# Altium schematic sheet MotherBoard_NucleoF401RE.SchDoc
size A; SheetNumber: 3; SheetTotal: 9
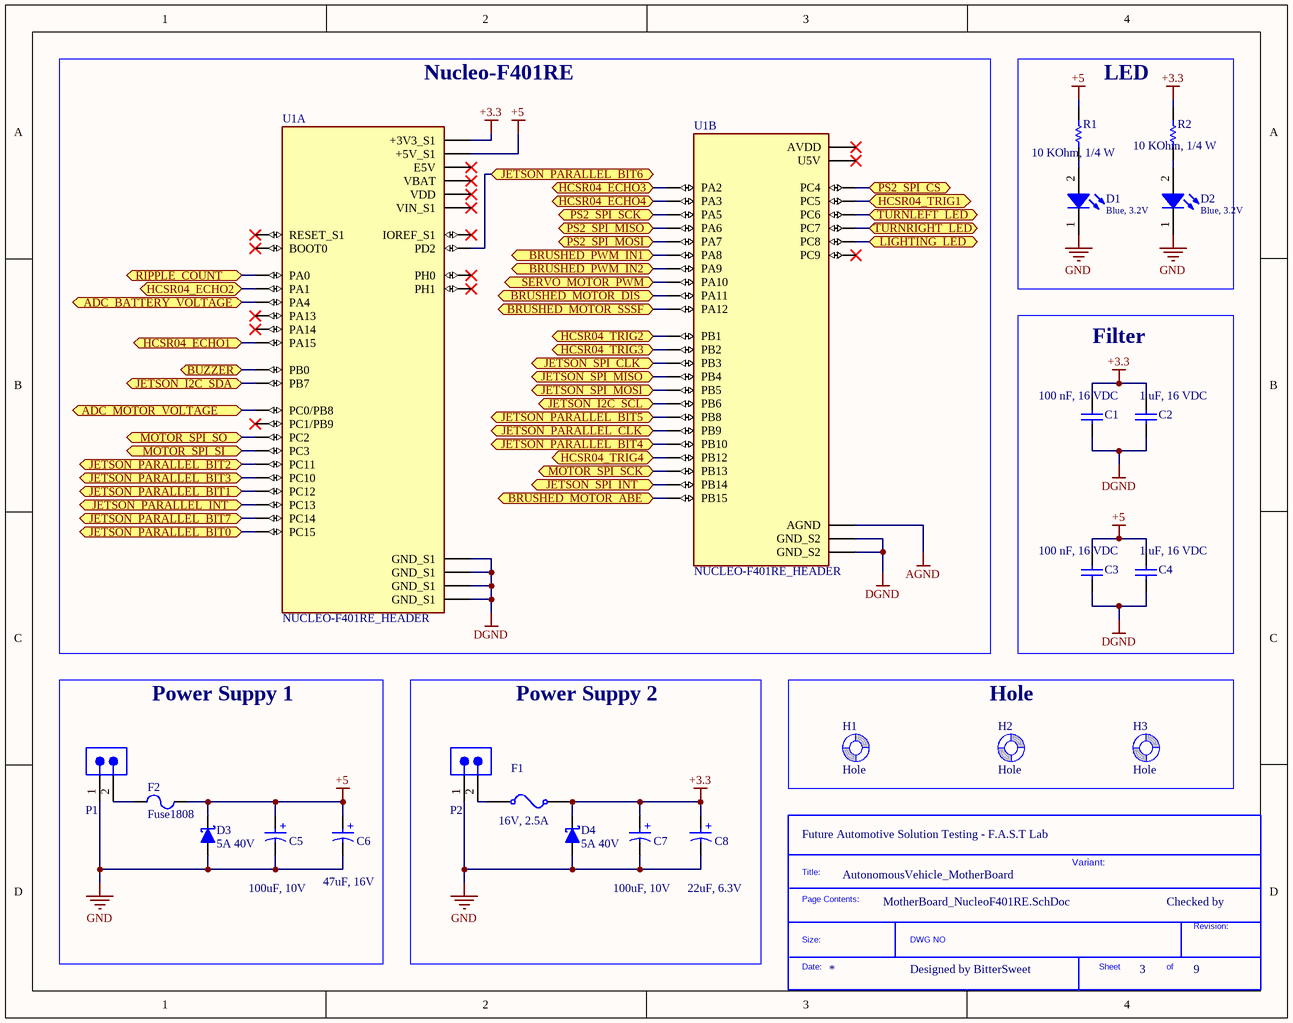
[diagram p0: MotherBoard_NucleoF401RE.SchDoc]

## Parts
*?  SDTitleBlock  (value not drawn)  (graphical)
C1  100 nF, 16 VDC  [CAP_0603]
C2  1 uF, 16 VDC  [CAP_0603]
C3  100 nF, 16 VDC  [CAP_0603]
C4  1 uF, 16 VDC  [CAP_0603]
C5  100uF, 10V  [WCAP-ASLI_D5H5.5]
C6  47uF, 16V  [WCAP-ASLI_D5H5.5]
C7  100uF, 10V  [WCAP-ASLI_D5H5.5]
C8  22uF, 6.3V  [WCAP-ASLI_D4H5.5]
D1  Blue, 3.2V  [WL-SMCW_0603_H=0.7mm]
D2  Blue, 3.2V  [WL-SMCW_0603_H=0.7mm]
D3  5A 40V  [DO-214AB, SMC]
D4  5A 40V  [DO-214AB, SMC]
F1  16V, 2.5A  [Fuse_SMD_1812]
F2  Fuse1808  [FuseHolder1808]
H1  Hole  [Hole_3.2mm]
H2  Hole  [Hole_3.2mm]
H3  Hole  [Hole_3.2mm]
P1  20A, 300V  [691312510002]  (value not drawn)
P2  20A, 300V  [691312510002]  (value not drawn)
R1  10 KOhm, 1/4 W  [resistor_0603]
R2  10 KOhm, 1/4 W  [resistor_0603]
U1  NUCLEO-F401RE_HEADER  [NUCLEO-F401RE-HEADER]  (parts A,B of 2)

## Blocks framed on the sheet
Nucleo-F401RE: U1
LED: D1 D2 R1 R2
Filter: C1-C4
Power Suppy 1: C5 C6 D3 F2 P1
Power Suppy 2: C7 C8 D4 F1 P2
Hole: H1-H3

## Ports
ADC_BATTERY_VOLTAGE (bidir), ADC_MOTOR_VOLTAGE (bidir), BRUSHED_MOTOR_ABE (bidir), BRUSHED_MOTOR_DIS (bidir), BRUSHED_MOTOR_SSSF (bidir), BRUSHED_PWM_IN1 (bidir), BRUSHED_PWM_IN2 (bidir), BUZZER (bidir), HCSR04_ECHO1 (bidir), HCSR04_ECHO2 (bidir), HCSR04_ECHO3 (bidir), HCSR04_ECHO4 (bidir), HCSR04_TRIG1 (bidir), HCSR04_TRIG2 (bidir), HCSR04_TRIG3 (bidir), HCSR04_TRIG4 (bidir), JETSON_I2C_SCL (bidir), JETSON_I2C_SDA (bidir), JETSON_PARALLEL_BIT0 (bidir), JETSON_PARALLEL_BIT1 (bidir), JETSON_PARALLEL_BIT2 (bidir), JETSON_PARALLEL_BIT3 (bidir), JETSON_PARALLEL_BIT4 (bidir), JETSON_PARALLEL_BIT5 (bidir), JETSON_PARALLEL_BIT6 (bidir), JETSON_PARALLEL_BIT7 (bidir), JETSON_PARALLEL_CLK (bidir), JETSON_PARALLEL_INT (bidir), JETSON_SPI_CLK (bidir), JETSON_SPI_INT (bidir), JETSON_SPI_MISO (bidir), JETSON_SPI_MOSI (bidir), LIGHTING_LED (bidir), MOTOR_SPI_SCK (bidir), MOTOR_SPI_SI (bidir), MOTOR_SPI_SO (bidir), PS2_SPI_CS (bidir), PS2_SPI_MISO (bidir), PS2_SPI_MOSI (bidir), PS2_SPI_SCK (bidir), RIPPLE_COUNT (bidir), SERVO_MOTOR_PWM (bidir), TURNLEFT_LED (bidir), TURNRIGHT_LED (bidir)

## Nets
+3.3: C1.2 C2.2 C7.1(P) C8.1(P) D4.2(K) F1.1 R2.1 U1.CN7_16(+3V3_S1)
+5: C3.2 C4.2 C5.1(P) C6.1(P) D3.2(K) F2.2 R1.1 U1.CN7_18(+5V_S1)
AGND: U1.CN10_32(AGND)
DGND: C1.1 C2.1 C3.1 C4.1 U1.CN7_8(GND_S1) U1.CN7_19(GND_S1) U1.CN7_20(GND_S1) U1.CN7_22(GND_S1) U1.CN10_9(GND_S2) U1.CN10_20(GND_S2)
GND: C5.2(N) C6.2(N) C7.2(N) C8.2(N) D1.1(K) D2.1(K) D3.1(A) D4.1(A) P1.1 P2.1
ADC_BATTERY_VOLTAGE: U1.CN7_32(PA4) ; port ADC_BATTERY_VOLTAGE
ADC_MOTOR_VOLTAGE: U1.CN7_38(PC0/PB8) ; port ADC_MOTOR_VOLTAGE
BRUSHED_MOTOR_ABE: U1.CN10_26(PB15) ; port BRUSHED_MOTOR_ABE
BRUSHED_MOTOR_DIS: U1.CN10_14(PA11) ; port BRUSHED_MOTOR_DIS
BRUSHED_MOTOR_SSSF: U1.CN10_12(PA12) ; port BRUSHED_MOTOR_SSSF
BRUSHED_PWM_IN1: U1.CN10_23(PA8) ; port BRUSHED_PWM_IN1
BRUSHED_PWM_IN2: U1.CN10_21(PA9) ; port BRUSHED_PWM_IN2
BUZZER: U1.CN7_34(PB0) ; port BUZZER
HCSR04_ECHO1: U1.CN7_17(PA15) ; port HCSR04_ECHO1
HCSR04_ECHO2: U1.CN7_30(PA1) ; port HCSR04_ECHO2
HCSR04_ECHO3: U1.CN10_35(PA2) ; port HCSR04_ECHO3
HCSR04_ECHO4: U1.CN10_37(PA3) ; port HCSR04_ECHO4
HCSR04_TRIG1: U1.CN10_6(PC5) ; port HCSR04_TRIG1
HCSR04_TRIG2: U1.CN10_24(PB1) ; port HCSR04_TRIG2
HCSR04_TRIG3: U1.CN10_22(PB2) ; port HCSR04_TRIG3
HCSR04_TRIG4: U1.CN10_16(PB12) ; port HCSR04_TRIG4
JETSON_I2C_SCL: U1.CN10_17(PB6) ; port JETSON_I2C_SCL
JETSON_I2C_SDA: U1.CN7_21(PB7) ; port JETSON_I2C_SDA
JETSON_PARALLEL_BIT0: U1.CN7_27(PC15) ; port JETSON_PARALLEL_BIT0
JETSON_PARALLEL_BIT1: U1.CN7_3(PC12) ; port JETSON_PARALLEL_BIT1
JETSON_PARALLEL_BIT2: U1.CN7_2(PC11) ; port JETSON_PARALLEL_BIT2
JETSON_PARALLEL_BIT3: U1.CN7_1(PC10) ; port JETSON_PARALLEL_BIT3
JETSON_PARALLEL_BIT4: U1.CN10_25(PB10) ; port JETSON_PARALLEL_BIT4
JETSON_PARALLEL_BIT5: U1.CN10_3(PB8) ; port JETSON_PARALLEL_BIT5
JETSON_PARALLEL_BIT6: U1.CN7_4(PD2) ; port JETSON_PARALLEL_BIT6
JETSON_PARALLEL_BIT7: U1.CN7_25(PC14) ; port JETSON_PARALLEL_BIT7
JETSON_PARALLEL_CLK: U1.CN10_5(PB9) ; port JETSON_PARALLEL_CLK
JETSON_PARALLEL_INT: U1.CN7_23(PC13) ; port JETSON_PARALLEL_INT
JETSON_SPI_CLK: U1.CN10_31(PB3) ; port JETSON_SPI_CLK
JETSON_SPI_INT: U1.CN10_28(PB14) ; port JETSON_SPI_INT
JETSON_SPI_MISO: U1.CN10_27(PB4) ; port JETSON_SPI_MISO
JETSON_SPI_MOSI: U1.CN10_29(PB5) ; port JETSON_SPI_MOSI
LIGHTING_LED: U1.CN10_2(PC8) ; port LIGHTING_LED
MOTOR_SPI_SCK: U1.CN10_30(PB13) ; port MOTOR_SPI_SCK
MOTOR_SPI_SI: U1.CN7_37(PC3) ; port MOTOR_SPI_SI
MOTOR_SPI_SO: U1.CN7_35(PC2) ; port MOTOR_SPI_SO
PS2_SPI_CS: U1.CN10_34(PC4) ; port PS2_SPI_CS
PS2_SPI_MISO: U1.CN10_13(PA6) ; port PS2_SPI_MISO
PS2_SPI_MOSI: U1.CN10_15(PA7) ; port PS2_SPI_MOSI
PS2_SPI_SCK: U1.CN10_11(PA5) ; port PS2_SPI_SCK
RIPPLE_COUNT: U1.CN7_28(PA0) ; port RIPPLE_COUNT
SERVO_MOTOR_PWM: U1.CN10_33(PA10) ; port SERVO_MOTOR_PWM
TURNLEFT_LED: U1.CN10_4(PC6) ; port TURNLEFT_LED
TURNRIGHT_LED: U1.CN10_19(PC7) ; port TURNRIGHT_LED
NetD1_2: D1.2(A) R1.2
NetD2_2: D2.2(A) R2.2
NetF1_0: F1.0 P2.2
NetF2_1: F2.1 P1.2

Not connected (* = marked no-connect by the designer): H1 1(Screw); H2 1(Screw); H3 1(Screw); U1 CN7_5(VDD)* CN7_6(E5V)* CN7_7(BOOT0)* CN7_12(IOREF_S1)* CN7_13(PA13)* CN7_14(RESET_S1)* CN7_15(PA14)* CN7_24(VIN_S1)* CN7_29(PH0)* CN7_31(PH1)* CN7_33(VBAT)* CN7_36(PC1/PB9)* CN10_1(PC9)* CN10_7(AVDD)* CN10_8(U5V)*

## Notes on the sheet
- (near *?) Future Automotive Solution Testing - F.A.S.T Lab
- AutonomousVehicle_MotherBoard
- Variant:
- Checked by
- Designed by BitterSweet
- (in symbol 865080140001) +
- (in symbol 865080142007) +
- (in symbol 865080342006) +
- (in symbol SDTitleBlock) Title:; Page Contents:; Revision:; Size:; DWG NO; Date:; Sheet; of

## Library data of the parts
C1 C3 = 0106031041050: CAP, size 0603, 100 nF, 16 VDC; Manufacture Name: TDK; Manufacture SN: CGA3E3X8R1H104K080AE; Capacitance: 100 nF; Tolerance: +/-10%; Voltage Rating DC: 16 VDC; ComponentLink2Description: Datasheet; ComponentLink2URL: https://product.tdk.com/system/files/dam/doc/product/capacitor/ceramic/mlcc/catalog/mlcc_automotive_soft_en.pdf?ref_disty=mouser; Operating Temperature: -55 to +125degC; Packaging: Tape and Reel; Mounting Technology: SMT; Size: 0603; Supplier 1 Name: Mouser; Supplier 1 SN: 810-CGA3E3X8R1H104KA; Supplier 1 URL: https://www.mouser.com/ProductDetail/TDK/CGA3E3X8R1H104K080AE?qs=nQSIdc08i%252Bd8g3IRRgU2bw%3D%3D&utm_source=mouser-refine-download&utm_medium=file&utm_campaign=CGA3E3X8R1H104K080AE&utm_content=TDK; Supplier 2 Name: Digi-Key; Supplier 2 SN: 445-173697-2-ND; Supplier 2 URL: https://www.digikey.com/en/products/detail/tdk-corporation/cga3e3x8r1h104k080ae/5809262; Supplier 3 Name: thegioiic; Supplier 3 SN: N/A; Supplier 3 URL: https://www.thegioiic.com/tu-gom-0603-100nf-0-1uf-16v; Value: 100 nF, 16 VDC; JLCPCB Part: C2173920; ComponentLink3Description: JLCPCB Link; ComponentLink3URL: https://jlcpcb.com/partdetail/TaiyoYuden-EMK107B7104KAHT/C2173920
C2 C4 = 0106031051016: CAP, size 0603, 1 uF, 16 VDC; Manufacture Name: Samsung Electro-Mechanics; Manufacture SN: CL10B105KO8NNWC; Capacitance: 1 uF; Tolerance: +/-10%; Voltage Rating DC: 16 VDC; ComponentLink2Description: Datasheet; ComponentLink2URL: https://www.mouser.vn/datasheet/2/585/Samsung_MLCC_1837944-1929650.pdf; Operating Temperature: -55 to +125degC; Packaging: Tape and Reel; Mounting Technology: SMT; Size: 0603; Supplier 1 Name: Mouser; Supplier 1 SN: 187-CL10B105KO8NNWC; Supplier 1 URL: https://www.mouser.vn/ProductDetail/Samsung-Electro-Mechanics/CL10B105KO8NNWC?qs=81r%252BiQLm7BT%252BXtc72qn1ug%3D%3D&utm_source=mouser-refine-download&utm_medium=file&utm_campaign=CL10B105KO8NNWC&utm_content=Samsung-Electro-Mechanics; Supplier 2 Name: Digi-Key; Supplier 2 SN: 1276-CL10B105KO8NNWCTR-ND; Supplier 2 URL: https://www.digikey.com/en/products/detail/samsung-electro-mechanics/cl10b105ko8nnwc/16572783; Supplier 3 Name: thegioiic; Supplier 3 SN: N/A; Supplier 3 URL: https://www.thegioiic.com/tu-gom-0603-1uf-16v; Value: 1 uF, 16 VDC; JLCPCB Part: C106858; ComponentLink3Description: JLCPCB Link; ComponentLink3URL: https://jlcpcb.com/partdetail/Yageo-CC0603KRX7R8BB105/C106858
C5 C7 = 865080142007: V-Chip, D5 x H5.5mm, 100uF, 10V; Manufacturer: Wurth Elektronik; Capacitance Tolerance: +/-20%; Dissipation Factor: 24%; Endurance: 2000h; Leakage Current: 6.3uA; Ripple Current: 170mA; Category: Aluminum Electrolytic Capacitors; ComponentLink2Description: Datasheet Link; ComponentLink2URL: https://www.we-online.com/redexpert/spec/865080142007?ad; Operating Temperature Max: 105°C; Operating Temperature Min: -55°C; Packaging: Tape and Reel; Height: 5.5mm; Diameter: 5mm; Capacitance: 100uF; Rated Voltage (DC): 10V; Supplier 1 Name: Mouser; Supplier 1 SN: 710-865080142007; Supplier 1 URL: https://www.mouser.vn/ProductDetail/Wurth-Elektronik/865080142007?qs=0KOYDY2FL2%2Fwso3YmuIP2w%3D%3D; Supplier 3 Name: thegioiic; Supplier 3 URL: https://www.thegioiic.com/tu-nhom-smd-100uf-10v-5x5-4mm-panasonic-eee1aa101war; Manufacturer Part Number: N/A; Mount: Surface Mount; Supplier 2 Name: Digi-Key; Supplier 2 SN: N/A; Supplier 2 URL: N/A; Supplier 3 SN: N/A; Value: 100uF, 10V; JLCPCB Part: C402534; ComponentLink3Description: JLCPCB Link; ComponentLink3URL: https://jlcpcb.com/partdetail/387824-HV101M010C055ETR/C402534
C6 = 865080342006: V-Chip, D5 x H5.5mm, 47uF, 16V; Manufacturer: Wurth Elektronik; Capacitance Tolerance: +/-20%; Dissipation Factor: 16%; Endurance: 2000h; Leakage Current: 7.52uA; Ripple Current: 195mA; Category: Aluminum Electrolytic Capacitors; ComponentLink2Description: Datasheet Link; ComponentLink2URL: https://www.we-online.com/redexpert/spec/865080342006?ad; Mount: Surface Mount; Operating Temperature Max: 105°C; Operating Temperature Min: -55°C; Packaging: Tape and Reel; Height: 5.5mm; Diameter: 5mm; Capacitance: 47uF; Rated Voltage (DC): 16V; Supplier 1 Name: Mouser; Supplier 1 SN: 710-865080262015; Supplier 1 URL: https://www.mouser.com/ProductDetail/Wurth-Elektronik/865080262015?qs=0KOYDY2FL2%2Ffe5w2MssUoQ%3D%3D; Supplier 3 Name: thegioiic; Supplier 3 URL: https://www.thegioiic.com/tu-nhom-smd-47uf-16v-5x5-4mm; Manufacturer Part Number: N/A; Supplier 2 Name: Digi-Key; Supplier 2 SN: N/A; Supplier 2 URL: N/A; Supplier 3 SN: N/A; Value: 47uF, 16V; JLCPCB Part: C84357; ComponentLink3Description: JLCPCB Link; ComponentLink3URL: https://jlcpcb.com/partdetail/85527-ZV470M016C055ETR/C84357
C8 = 865080140001: V-Chip, D4 x H5.8mm, 22uF, 6.3V; Manufacturer: Wurth Elektronik; Capacitance Tolerance: +/-20%; Dissipation Factor: 24%; Endurance: 2000h; Leakage Current: 3uA; Ripple Current: 75mA; Category: Aluminum Electrolytic Capacitors; ComponentLink2Description: Datasheet Link; ComponentLink2URL: https://www.we-online.com/redexpert/spec/865080140001?ad; Mount: Surface Mount; Operating Temperature Max: 105°C; Operating Temperature Min: -55°C; Packaging: Tape and Reel; Height: 5.8mm; Diameter: 4mm; Capacitance: 22uF; Rated Voltage (DC): 6.3V; Supplier 1 Name: Mouser; Supplier 1 SN: 865080140001; Supplier 1 URL: https://www.mouser.vn/ProductDetail/Wurth-Elektronik/865080140001?qs=0KOYDY2FL2%2FITcChMQdw%252BQ%3D%3D&_gl=1*175azx5*_ga*MzUyMDUxMTAxLjE2ODc3NDI0MDM.*_ga_15W4STQT4T*MTY4OTEwMTM0NC4yLjAuMTY4OTEwMTM0NS4wLjAuMA..*_ga_1KQLCYKRX3*MTY4OTEwMTM0NC4yLjAuMTY4OTEwMTM0NS41OS4wLjA.; Supplier 3 Name: thegioiic; Supplier 3 SN: EEEFP0J220AR; Supplier 3 URL: https://www.thegioiic.com/tu-nhom-smd-22uf-6-3v-4x5-8mm-panasonic-eeefp0j220ar; Manufacturer Part Number: N/A; Supplier 2 Name: Digi-Key; Supplier 2 SN: N/A; Supplier 2 URL: N/A; Value: 22uF, 6.3V; ComponentLink3Description: JLCPCB Link; ComponentLink3URL: https://jlcpcb.com/partdetail/Panasonic-EEEFKC220UAR/C401733; JLCPCB Part: C401733
D1 D2 = 160603BlueClear: WL-SMCW SMT Mono-color Chip LED Waterclear, size 0603, Blue, 3.2V, 140deg; Type: Clear; Color: Blue; Size: 0603; ComponentLink1Description: Datasheet link; ComponentLink1URL: N/A; ComponentLink2Description: Supplier 1 URL; ComponentLink2URL: https://www.mouser.vn/ProductDetail/Wurth-Elektronik/150060BS75003?qs=Li%252BoUPsLEnu8LvIbM48DKA%3D%3D; ComponentLink3Description: Supplier 2 URL; ComponentLink3URL: https://www.digikey.com/en/products/detail/liteon/LTST-C191TBKT/388530; ComponentLink4Description: Supplier 3 URL; ComponentLink4URL: https://www.thegioiic.com/led-xanh-duong-0603-dan-smd-trong-suot; Supplier 1 Name: Mouser; Supplier 1 SN: 710-150060GS75000; Supplier 1 URL: https://www.mouser.vn/ProductDetail/Wurth-Elektronik/150060BS75003?qs=Li%252BoUPsLEnu8LvIbM48DKA%3D%3D; Supplier 2 Name: Digi-Key; Supplier 2 SN: 160-1647-2-ND; Supplier 2 URL: https://www.digikey.com/en/products/detail/liteon/LTST-C191TBKT/388530; Supplier 3 Name: ICDayRoi; Supplier 3 SN: N/A; Supplier 3 URL: https://www.thegioiic.com/led-xanh-duong-0603-dan-smd-trong-suot; Value: Blue, 3.2V; JLCPCB Part: C99290; ComponentLink5Description: JLCPCB Link; ComponentLink5URL: https://jlcpcb.com/partdetail/LiteOn-LTSTC191TBKT/C99290
D3 D4 = Diode_Schottky: SS54 SMC Diode Schottky 5A 40V; JLCPCB Part: C2904822; ComponentLink1Description: JLCPCB Link; ComponentLink1URL: https://jlcpcb.com/partdetail/YONGYUTAI-SS54/C2904822
F1 = 061812250016: Resettable Fuse, Size 1812, 16V, 2.5A; Manufacturer: Bourns; Threshold Current: 100A; Trip Current: 5A; Threshold Voltage: 16V; Hold Current: 2.5A; Size: 1812; Mounting Technology: SMT/SMD; ComponentLink1Description: Datasheet link; ComponentLink1URL: https://www.bourns.com/docs/Product-Datasheets/mfnsmf.pdf; ComponentLink2Description: Supplier 1 URL; ComponentLink2URL: https://www.mouser.vn/ProductDetail/Bourns/MF-MSMF250-16X-2?qs=9fn1gpisni78zr7pGyDhCQ%3D%3D; ComponentLink3Description: Supplier 2 URL; ComponentLink3URL: https://www.digikey.com/en/products/detail/bourns-inc/MF-MSMF250-16X-2/2563289; ComponentLink4Description: Supplier 3 URL; ComponentLink4URL: https://www.thegioiic.com/mf-msmf250-16-cau-chi-tu-phuc-hoi-1812-16v-2-5a; Supplier 1 Name: Mouser; Supplier 1 SN: 652-MF-MSMF250/16X-2; Supplier 1 URL: https://www.mouser.vn/ProductDetail/Bourns/MF-MSMF250-16X-2?qs=9fn1gpisni78zr7pGyDhCQ%3D%3D; Supplier 2 Name: Digi-Key; Supplier 2 SN: MF-MSMF250/16X-2TR-ND; Supplier 2 URL: https://www.mouser.vn/ProductDetail/Bourns/MF-MSMF250-16X-2?qs=9fn1gpisni78zr7pGyDhCQ%3D%3D; Supplier 3 Name: thegioiic; Supplier 3 SN: MF-MSMF250/16; Supplier 3 URL: https://www.thegioiic.com/mf-msmf250-16-cau-chi-tu-phuc-hoi-1812-16v-2-5a; Value: 16V, 2.5A; JLCPCB Part: C210838; ComponentLink5Description: JLCPCB Link; ComponentLink5URL: https://jlcpcb.com/jp/partdetail/BOURNS-MF_MSMF250_16X2/C210838
F2 = Fuse1808: Fuse 1808 Holder SMD fast blow L9.73xW5.03xH3.81; JLCPCB Part: C206917; ComponentLink1Description: JLCPCB Link; ComponentLink1URL: https://jlcpcb.com/partdetail/Littelfuse-0154005DRT/C206917
P1 P2 = 691312510002: WR-TBL Series 312 Open Horizontal PCB Header, THT, pitch 5.08mm, 2p; Manufacturer: Wurth Elektronik; Modularity: No; ComponentLink1Description: Datasheet Link; ComponentLink1URL: https://www.we-online.com/redexpert/spec/691312510002?ad; ComponentLink2Description: Supplier 1 URL; ComponentLink2URL: N/A; Manufacturer Part Number: 691312510002; Category: Terminal Blocks; Match Code: WR-TBL; Mount: Through Hole; Operating Temperature Max: 105°C; Operating Temperature Min: -40°C; Packaging: Box; Application: Pluggable; Number of Pins: 2; Number of Rows: 1; Orientation: Horizontal; Pitch: 5.08mm; Rated Current: 20A; Working Voltage: 300V; ComponentLink3Description: Supplier 2 URL; ComponentLink3URL: N/A; ComponentLink4Description: Supplier 3 URL; ComponentLink4URL: https://www.thegioiic.com/kf-5-08-2-r-terminal-block-plug-in-han-pcb-2-chan-cong-5-08mm-300v-15a; Supplier 1 Name: Mouser; Supplier 1 SN: N/A; Supplier 1 URL: N/A; Supplier 2 Name: Digi-Key; Supplier 2 SN: N/A; Supplier 2 URL: N/A; Supplier 3 Name: thegioiic; Supplier 3 SN: N/A; Supplier 3 URL: https://www.thegioiic.com/kf-5-08-2-r-terminal-block-plug-in-han-pcb-2-chan-cong-5-08mm-300v-15a; Value: 20A, 300V
R1 R2 = 0006031031: RES, size 0603, 10 KOhm, 1/4 W; Manufacture  Name: OEM; Resistance: 10 KOhm; Rated Power: 1/4 W; Resistance Tolerance: +/-1%; Size: 0603; Mounting Technology: SMT; Supplier 1 Name: Mouser; Supplier 1 SN: 755-ESR03EZPF1002; Supplier 2 Name: Digi-Key; Supplier 2 SN: RHM10KADTR-ND RHM10KADCT-ND RHM10KADDKR-ND; Supplier 1 URL: https://www.mouser.vn/ProductDetail/ROHM-Semiconductor/ESR03EZPF1002?qs=sGAEpiMZZMvdGkrng054t67Efho1F8r6CDeAsqwFse8%3D; Supplier 3 Name: thegioiic; Supplier 3 SN: N/A; Supplier 3 URL: N/A; Manufacture  SN: OEM; Value: 10 KOhm, 1/4 W; ComponentLink1Description: Datasheet link; ComponentLink1URL: https://fscdn.rohm.com/en/products/databook/datasheet/passive/resistor/chip_resistor/esr-e.pdf; ComponentLink2Description: Supplier 1 URL; ComponentLink2URL: https://www.thegioiic.com/dien-tro-10-kohm-0603-1-; ComponentLink3Description: Supplier 2 URL; ComponentLink3URL: https://www.digikey.com/en/products/detail/rohm-semiconductor/ESR03EZPF1002/1983429; ComponentLink4Description: Supplier 3 URL; ComponentLink4URL: N/A; Supplier 2 URL: https://www.digikey.com/en/products/detail/rohm-semiconductor/ESR03EZPF1002/1983429; JLCPCB Part: C2087321; Parameter 1: *; ComponentLink5Description: JLCPCB Link; ComponentLink5URL: https://jlcpcb.com/partdetail/Yageo-RT0603BRD1010KL/C2087321
U1 = NUCLEO-F401RE_HEADER: STM32 Nucleo-64 development board with STM32F401RET6 MCU, supports Arduino and ST morpho connectivity; Availability: Unavailable; Price: None; Package: None; MP: NUCLEO-F401RE; Value: *